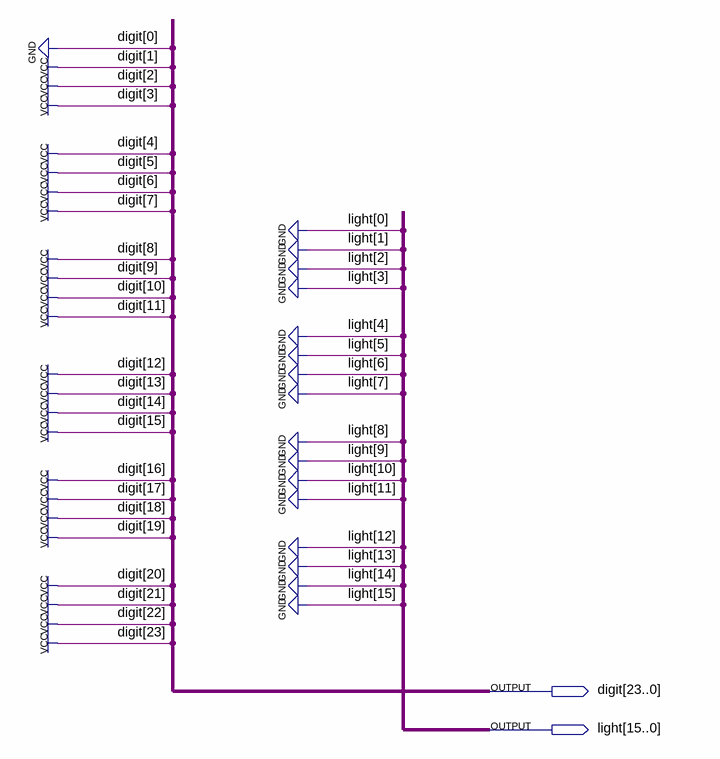
[diagram p0: schematic sheet]
// Quartus schematic Pattern_7_Frame_0.bdf as structural Verilog: 0 symbols, 2 pins
module Pattern_7_Frame_0 (
  output [23:0] digit,
  output [15:0] light
);


  assign digit = 24'b111111111111111111111110;
  assign light = {16{1'b0}};
endmodule
